# Altium schematic sheet SIM7600_M_V2.0.SchDoc
size A4
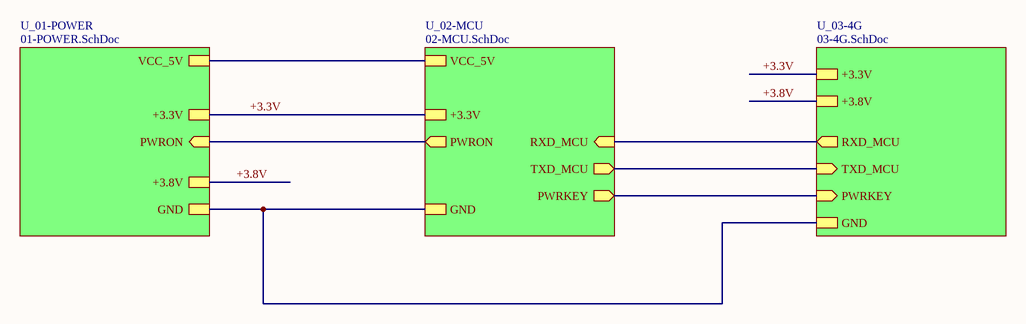
[diagram p0: SIM7600_M_V2.0.SchDoc]

## Sub-sheets
U_01-POWER = 01-POWER.SchDoc: GND, +3.8V, +3.3V, PWRON, VCC_5V
U_02-MCU = 02-MCU.SchDoc: GND, +3.3V, RXD_MCU, TXD_MCU, PWRKEY, PWRON, VCC_5V
U_03-4G = 03-4G.SchDoc: +3.8V, GND, RXD_MCU, TXD_MCU, +3.3V, PWRKEY

## Nets
+3.3V: sheet U_01-POWER/+3.3V, sheet U_02-MCU/+3.3V, sheet U_03-4G/+3.3V
+3.8V: sheet U_01-POWER/+3.8V, sheet U_03-4G/+3.8V
(unnamed): sheet U_01-POWER/GND, sheet U_02-MCU/GND, sheet U_03-4G/GND
(unnamed): sheet U_01-POWER/PWRON, sheet U_02-MCU/PWRON
(unnamed): sheet U_01-POWER/VCC_5V, sheet U_02-MCU/VCC_5V
(unnamed): sheet U_02-MCU/RXD_MCU, sheet U_03-4G/RXD_MCU
(unnamed): sheet U_02-MCU/TXD_MCU, sheet U_03-4G/TXD_MCU
(unnamed): sheet U_02-MCU/PWRKEY, sheet U_03-4G/PWRKEY